# Altium schematic sheet 4G.SchDoc
size A3; SheetNumber: 3; SheetTotal: 6
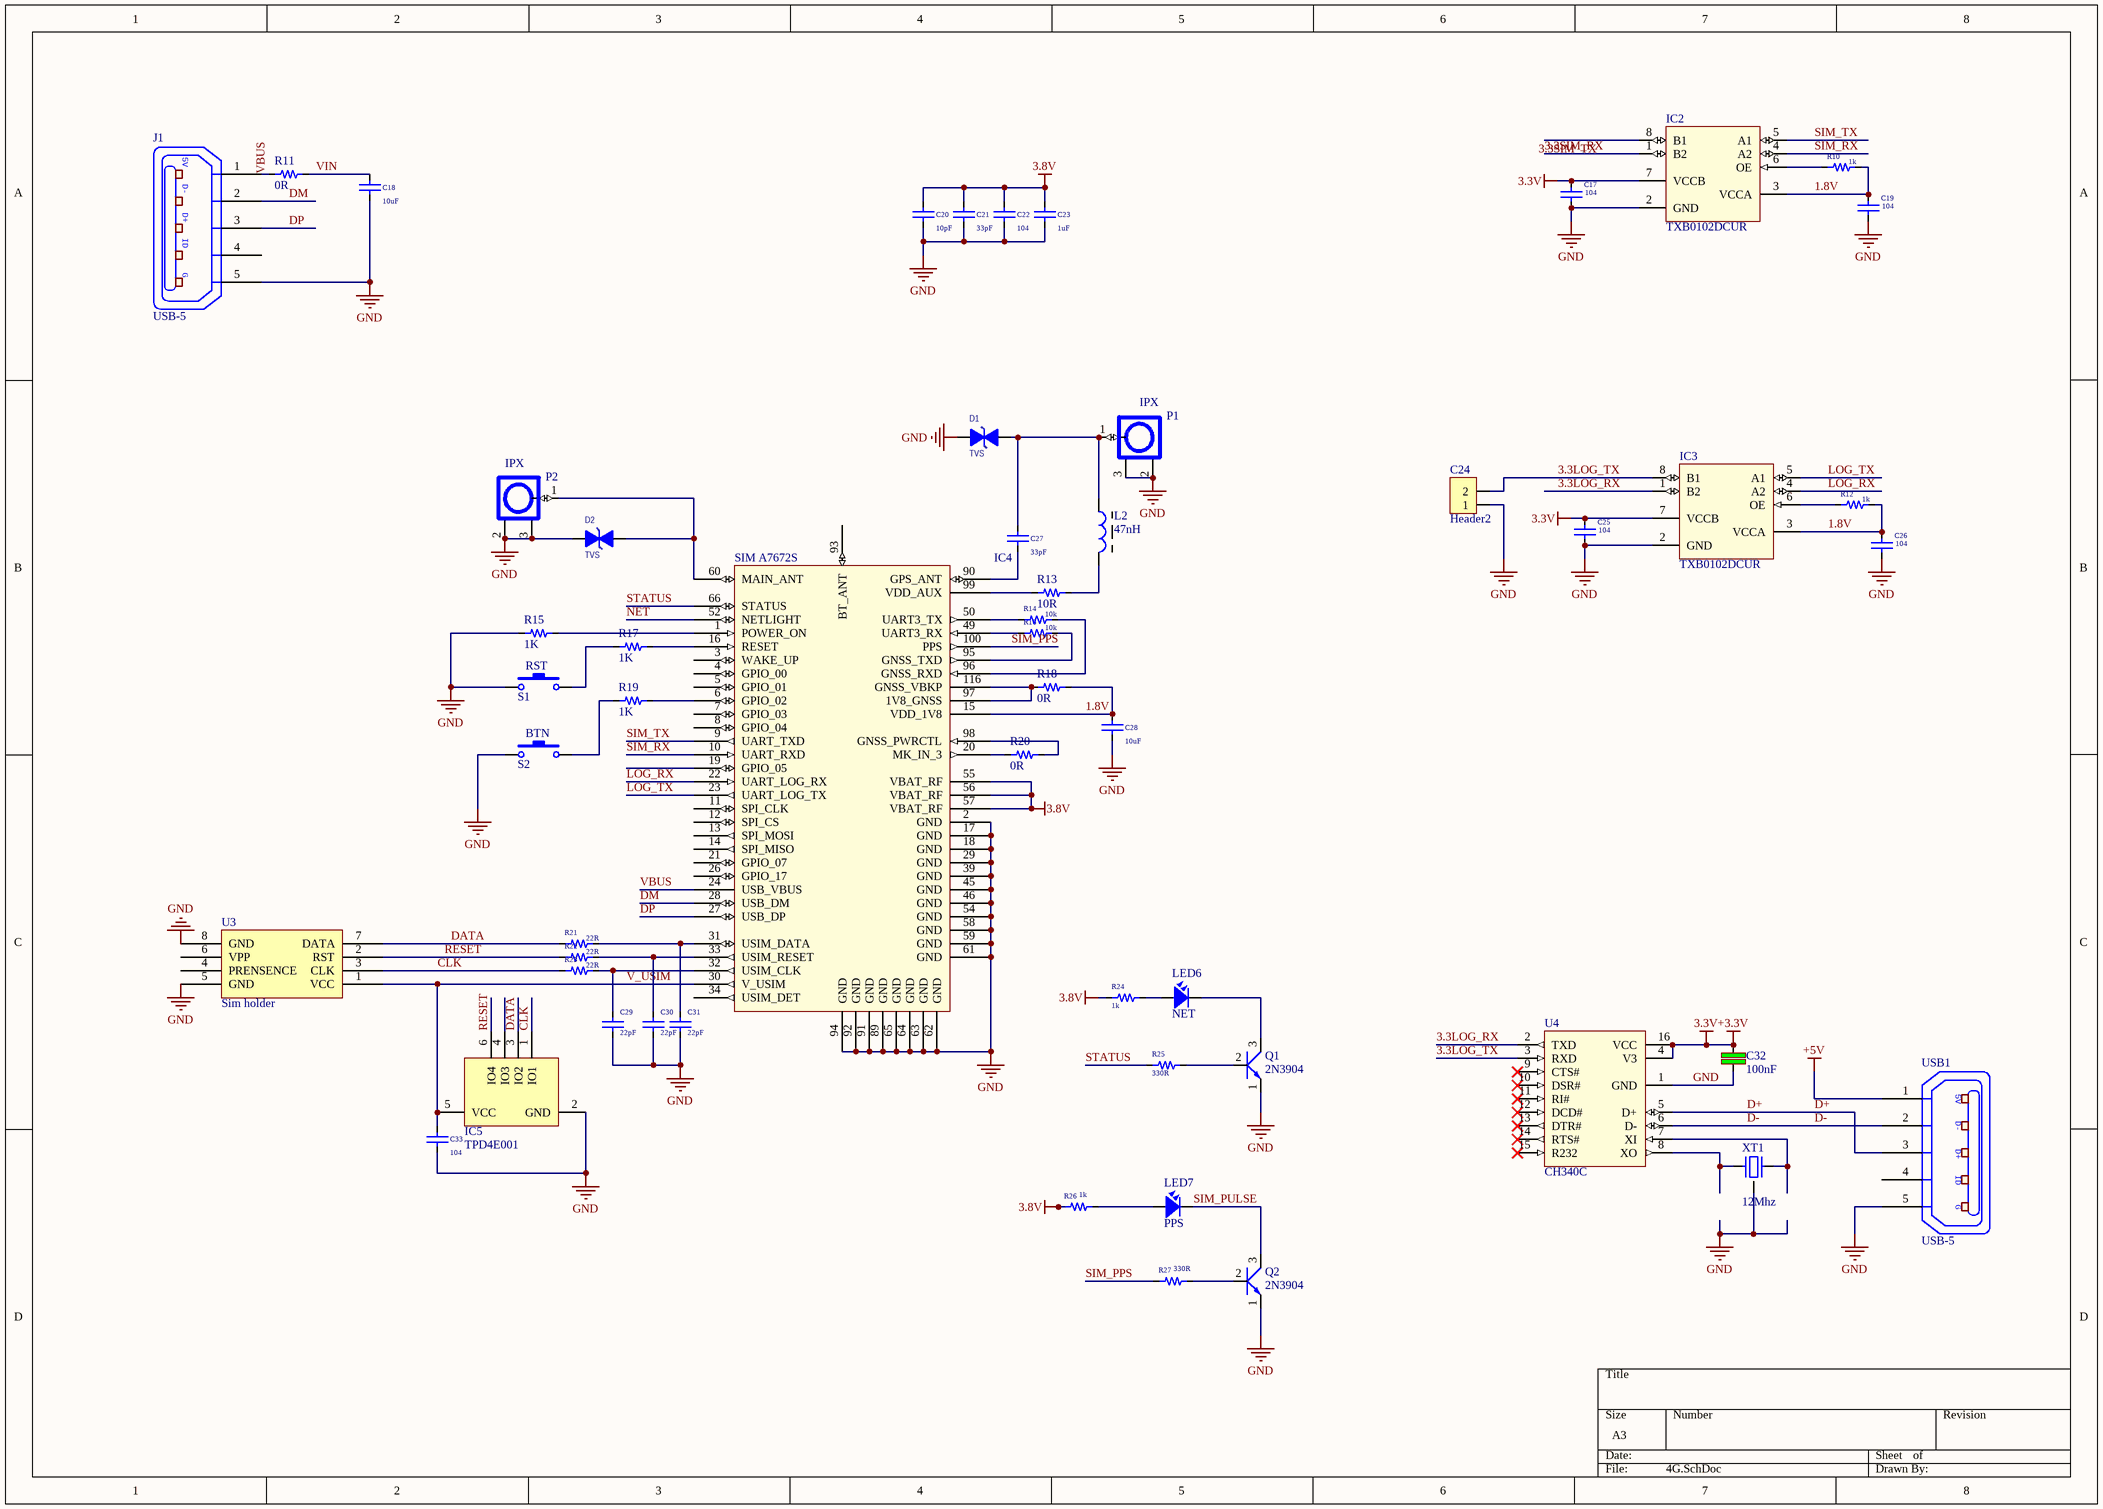
[diagram p0: 4G.SchDoc]

## Parts
C17  104  [CAP_0603]
C18  10uF  [CAP_0603]
C19  104  [CAP_0603]
C20  10pF  [CAP_0603]
C21  33pF  [CAP_0603]
C22  104  [CAP_0603]
C23  1uF  [CAP_0603]
C24  Header2  [JP2]
C25  104  [CAP_0603]
C26  104  [CAP_0603]
C27  33pF  [CAP_0603]
C28  10uF  [CAP_0603]
C29  22pF  [CAP_0603]
C30  22pF  [CAP_0603]
C31  22pF  [CAP_0603]
C32  100nF  [C-0805]
C33  104  [CAP_0603]
D1  TVS  [RES-SMD-0402]
D2  TVS  [RES-SMD-0402]
IC2  TXB0102DCUR  [TXB0102DCUR]
IC3  TXB0102DCUR  [TXB0102DCUR]
IC4  SIM A7672S  [A7672S]
IC5  TPD4E001  [TPD4E001]
J1  USB-5  [USB-M1]
L2  47nH  [RES-SMD-0603]
LED6  NET  [LED-0805-Blue]
LED7  PPS  [LED-0805-Blue]
P1  IPX  [IPXS]
P2  IPX  [IPXS]
Q1  2N3904  [SOT23C]
Q2  2N3904  [SOT23C]
R10  1k  [RES-SMD-0603]
R11  0R  [RES-SMD-0603]
R12  1k  [RES-SMD-0603]
R13  10R  [RES-SMD-0603]
R14  10k  [RES-SMD-0603]
R15  1K  [RES-SMD-0603]
R16  10k  [RES-SMD-0603]
R17  1K  [RES-SMD-0603]
R18  0R  [RES-SMD-0603]
R19  1K  [RES-SMD-0603]
R20  0R  [RES-SMD-0603]
R21  22R  [RES-SMD-0603]
R22  22R  [RES-SMD-0603]
R23  22R  [RES-SMD-0603]
R24  1k  [RES-SMD-0603]
R25  330R  [RES-SMD-0603]
R26  1k  [RES-SMD-0603]
R27  330R  [RES-SMD-0603]
S1  RST  [SW-SMD]
S2  BTN  [SW-SMD]
U3  Sim holder  [sim_holder_micro]
U4  CH340C  [SOP-16]
USB1  USB-5  [USB-M1]
XT1  12Mhz  [XT32-3]

## Nets
3.8V: C20.2 C21.2 C22.2 C23.2 IC4.55(VBAT_RF) IC4.56(VBAT_RF) IC4.57(VBAT_RF) R24.2 R26.2
+3.3V: C17.2 C25.2 C32.2 IC2.7(VCCB) IC3.7(VCCB) U4.4(V3) U4.16(VCC)  [also labelled 3.3V]
+5V: USB1.1(P1)
GND: C17.1 C18.1 C19.1 C20.1 C21.1 C22.1 C23.1 C24.1 C25.1 C26.1 C28.1 C29.1 C30.1 C31.1 C32.1 C33.1 D1.2(K) D2.2(K) IC2.2(GND) IC3.2(GND) IC4.2(GND) IC4.17(GND) IC4.18(GND) IC4.29(KEYPAD_0) IC4.39(GND) IC4.45(GND) IC4.46(ADC2) IC4.54(GPIO4) IC4.58(GND) IC4.59(GND) IC4.61(GND) IC4.62(GND) IC4.63(GND) IC4.64(GND) IC4.65(GND) IC4.89(GND) IC4.91(GND) IC4.92(GND) IC4.94(GND) IC5.2(GND) J1.5(P5) P1.2 P1.3 P2.2 P2.3 Q1.1(E) Q2.1(E) R15.1 S1.1 S2.1 U3.5(GND) U3.8(GND) U4.1(GND) USB1.5(P5) XT1.3
1.8V: C19.2 C26.2 C28.2 IC2.3(VCCA) IC3.3(VCCA) IC4.15(RESERVED) R10.1 R12.1 R18.2
3.3LOG_RX: IC3.1(B2) U4.2(TXD)
3.3LOG_TX: C24.2 IC3.8(B1) U4.3(RXD)
3.3SIM_RX: IC2.1(B2)
3.3SIM_TX: IC2.8(B1)
CLK: IC5.1(IO1) R23.2 U3.3(CLK)
D+: U4.5(D+) USB1.3(P3)
D-: U4.6(D-) USB1.2(P2)
DATA: IC5.3(IO2) R21.2 U3.7(DATA)
DM: IC4.28(KEYSENSE_N0) J1.2(P2)
DP: IC4.27(KEYSENSE_N1) J1.3(P3)
LOG_RX: IC3.4(A2) IC4.22(SPK_P)
LOG_TX: IC3.5(A1) IC4.23(MIC1P)
NET: IC4.52(GPIO41)
RESET: IC5.6(IO4) R22.2 U3.2(RST)
SIM_PPS: IC4.100(PPS) R27.2
SIM_PULSE: LED7.2 Q2.3(C)
SIM_RX: IC2.4(A2) IC4.10(UART_RXD)
SIM_TX: IC2.5(A1) IC4.9(UART_TXD)
STATUS: IC4.66(STATUS) R25.2
V_USIM: C33.2 IC4.30(KEYPAD_2) IC5.5(VCC) U3.1(VCC)
VBUS: IC4.24(MIC1N) J1.1(P1) R11.1
VIN: C18.2 R11.2
NetC27_1: C27.1 IC4.90(GPS_ANT)
NetC27_2: C27.2 D1.1(A) L2.1 P1.1
NetC29_2: C29.2 IC4.32(KEYSENSE_N3) R23.1
NetC30_2: C30.2 IC4.33(KEYPAD_1) R22.1
NetC31_2: C31.2 IC4.31(KEYSENSE_N2) R21.1
NetD2_1: D2.1(A) IC4.60(MAIN_ANT) P2.1
NetIC2_6: IC2.6(OE) R10.2
NetIC3_6: IC3.6(OE) R12.2
NetIC4_1: IC4.1(POWER_ON) R15.2
NetIC4_6: IC4.6(GPIO_02) R19.1
NetIC4_16: IC4.16(RESERVED) R17.2
NetIC4_20: IC4.20(MK_IN_3) R20.1
NetIC4_49: IC4.49(GPIO40) R16.2
NetIC4_50: IC4.50(GPIO43) R14.2
NetIC4_95: IC4.95(GNSS_TXD) R16.1
NetIC4_96: IC4.96(GNSS_RXD) R14.1
NetIC4_97: IC4.97(1V8_GNSS) IC4.116(GNSS_VBKP) R18.1
NetIC4_98: IC4.98(GNSS_PWRCTL) R20.2
NetIC4_99: IC4.99(VDD_AUX) R13.1
NetL2_2: L2.2 R13.2
NetLED6_1: LED6.1 R24.1
NetLED6_2: LED6.2 Q1.3(C)
NetLED7_1: LED7.1 R26.1
NetQ1_2: Q1.2(B) R25.1
NetQ2_2: Q2.2(B) R27.1
NetR17_1: R17.1 S1.2
NetR19_2: R19.2 S2.2
NetU4_7: U4.7(XI) XT1.2
NetU4_8: U4.8(XO) XT1.1

Not connected (* = marked no-connect by the designer): IC4 3(WAKE_UP) 4(GPIO_00) 5(GPIO_01) 7(GPIO_03) 8(GPIO_04) 11(SPI_CLK) 12(SPI_CS) 13(SPI_MOSI) 14(SPI_MISO) 19(GPIO_05) 21(SPK_M) 25(EAR1N) 26(EAR1P) 34(KEYPAD_4) 35(KEYPAD_3) 36(KEYSENSE_N4) 47(ADC1) 48(GPIO44) 51(GPIO1) 53(GPIO42) 73(PCM_DOUT) 74(PCM_DIN) 75(PCM_SYNC) 76(PCM_CLK) 93(BT_ANT); IC5 4(IO3); J1 4(P4); U3 4(PRENSENCE) 6(VPP); U4 9(CTS#)* 10(DSR#)* 11(RI#)* 12(DCD#)* 13(DTR#)* 14(RTS#)* 15(R232)*; USB1 4(P4)

## Notes on the sheet
- (in symbol USB-5) 5V; D-; D+; ID; G

## Library data of the parts
C17-C23 C25-C31 C33 = CapSMD: Capacitor; Value: 33p; Published: 8-Jun-2000; LatestRevisionDate: 17-Jul-2002; LatestRevisionNote: Re-released for DXP Platform.; PackageReference: RAD-0.3; Publisher: Altium Limited
C24 = Header2: Header IDC, 2 x 1 Pin Vertical 2.54mm Pitch (Non-Boxed, Male); Manufacturer: W¨¹rth Elektronik eiSos GmbH; partNo: 613002143121; ComponentLink1 Description: Manufacturer; ComponentLink2 Description: Datasheet; NoPins: 02; Created Date: 29 March 2013; ComponentLink1URL: http://www.we-online.com; ComponentLink2URL: http://katalog.we-online.de/em/datasheet/6130xx143121.pdf; Created by: Karrer Zheng
C32 = C: Cap SMD; Manufacturer: Samsung Electro-Mechanics; Part number: CL21B104KBCNNWC; User_Description: CAP CER 0.1UF 50V X7R 0805; Value: 100nF; Category: CAPACITOR; Package: 0805
D1 D2 = TVS: TVS DIODE 4VWM 1005; Manufacturer: Murata Electronics; Part number: LXES15AAA1-153; Value: 4V; Category: Circuit Protection; Package: 0402; User_Description: TVS DIODE 4VWM 1005
IC2 IC3 = TXB0102DCUR: IC TRNSLTR BIDIRECTIONAL US8; Manufacturer: Texas Instruments; Category: IC Logic Level; Package: 8-VSSOP; Part number: TXB0102DCUR; User_Description: IC TRNSLTR BIDIRECTIONAL US8
IC4 = SIM A7672S: SIM A7672S-CAT-M1; Part number: SIM A7672S
IC5 = TPD4E001_1: Manufacturer: Texas Instruments; Part number: TPD4E001RDBVR; User_Description: TVS DIODE 5.5VWM SC70-6; Category: Circuit Protection; Package: SOT-363
J1 USB1 = USB-5: Manufacturer: FCI; Category: Connectors, Interconnects
L2 = Inductor Ferit: FIXED IND 47NH 300MA 700MOHM SMD; Manufacturer: Taiyo Yuden; Part number: HK160847NJ-T; Value: 150 mH; Category: INDUCTORS; Package: 0603; User_Description: FIXED IND 47NH 300MA 700MOHM SMD
LED6 LED7 = LED: LED Single colour Green and Red; Value: LED 3 ly Single Colour
P1 P2 = IPXSx66: Antenna GSM GPS; Manufacturer: TE Connectivity AMP Connectors; Part number: 2334884-1; User_Description: UMCC MICRO-COAX RECEPTACLE, GEN; Category: Connectors; Package: SMD
Q1 Q2 = 2N904: NPN 600mW, ECB; Value: C1815
R10-R27 = Resistor - SMD: Resistor; Manufacturer: Generic Components; Class: Passive; Published: 08/06/2000; Publisher: Altium Hobart Technology Centre
S1 S2 = SW-SMD: Switch; Published: 24-Mar-1999; LatestRevisionDate: 17-Jul-2002; LatestRevisionNote: Re-released for DXP Platform.; PackageReference: SPST-2; Publisher: Altium Limited
U3 = Component_1
U4 = CH340G: USB to UART Interface; Manufacturer: WCH; Category: IC UART Interface; Package: SOIC-16; Part number: CH340G; User_Description: USB to UART Interface
XT1 = XT32k: Crystal 32,768kHz for timer real; Value: 32,768khz